# Altium project IntelligentJunctionBox_V1.PrjPcb
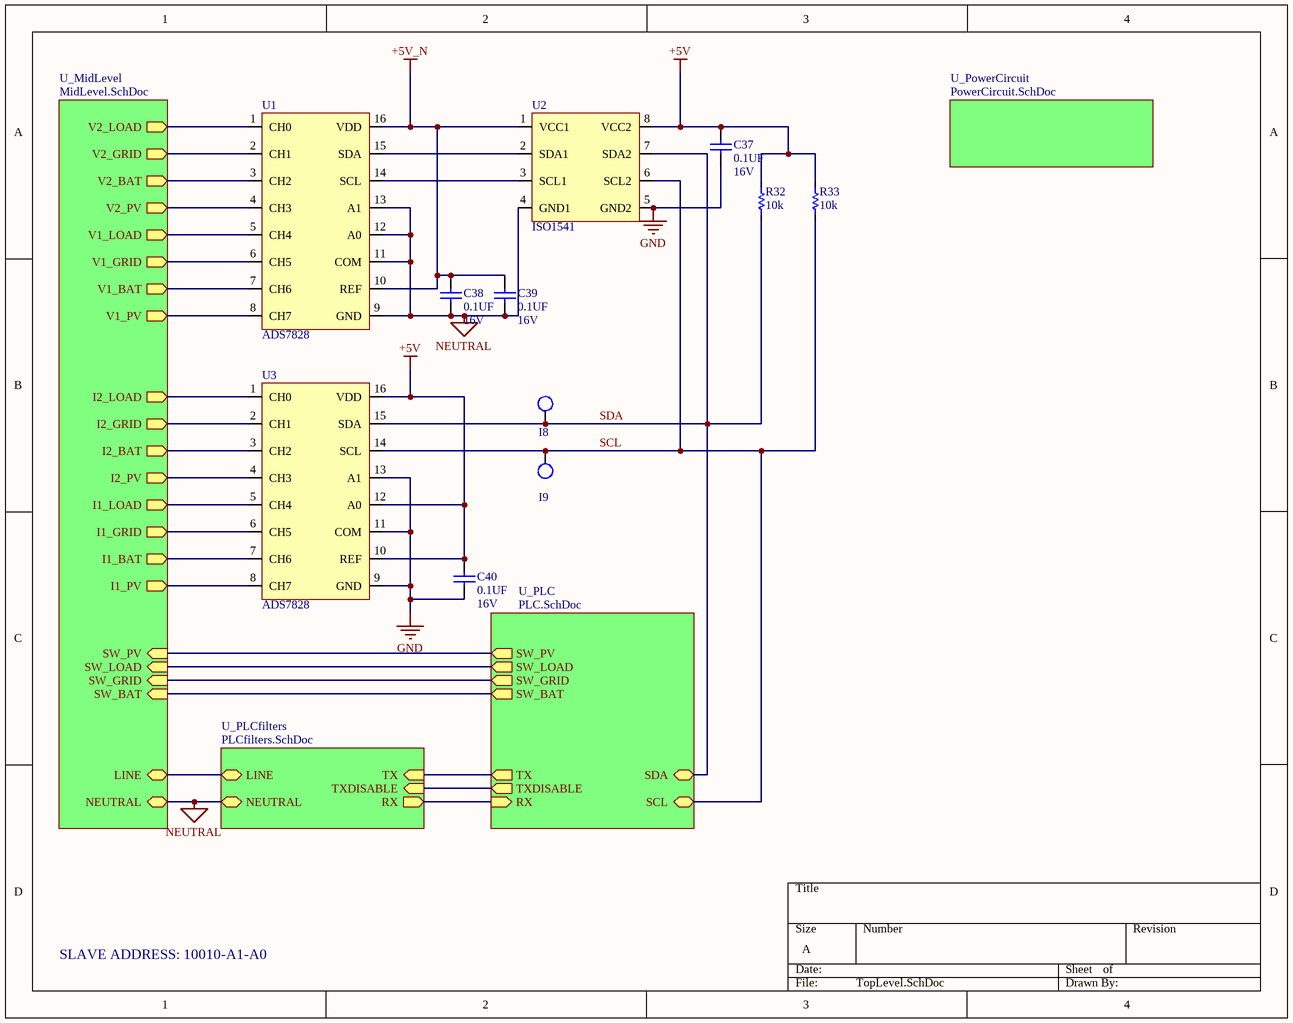
[diagram p0: TopLevel.SchDoc]
3 sheets, 42 parts. Net scope: hierarchical (ports join the sheet entries above them; power ports are global).
Board file: IntelligentJunctionBox_V1.PcbDoc
Sheets:
  TopLevel.SchDoc
    U_PLC = PLC.SchDoc
  Vsense.SchDoc

## Sheet TopLevel.SchDoc
size A

### Parts
C37  Capacitance: 0.1UF  Voltage - Rated: 16V  [CAPC1608X08N]  (hidden comment: GRM188R71C104KA01D)
C38  Capacitance: 0.1UF  Voltage - Rated: 16V  [CAPC1608X08N]  (hidden comment: GRM188R71C104KA01D)
C39  Capacitance: 0.1UF  Voltage - Rated: 16V  [CAPC1608X08N]  (hidden comment: GRM188R71C104KA01D)
C40  Capacitance: 0.1UF  Voltage - Rated: 16V  [CAPC1608X08N]  (hidden comment: GRM188R71C104KA01D)
I8  Testpoint  [Testpoint]  (value not drawn)
I9  Testpoint  [Testpoint]  (value not drawn)
R32  Resistance: 10k  [RESC1608X06N]  (hidden comment: RC0603FR-0710KL)
R33  Resistance: 10k  [RESC1608X06N]  (hidden comment: RC0603FR-0710KL)
U1  ADS7828  [TSOP65P640X120-16N]
U2  ISO1541  [SOIC127P600X175-8N]
U3  ADS7828  [TSOP65P640X120-16N]

### Sub-sheets
U_MidLevel = MidLevel.SchDoc (file not in this document): V1_PV (out), V2_PV (out), I1_PV (out), I2_PV (out), SW_PV (in), V1_LOAD (out), V2_LOAD (out), I1_LOAD (out), I2_LOAD (out), SW_LOAD (in), V1_GRID (out), V2_GRID (out), I1_GRID (out), I2_GRID (out), SW_GRID (in), V1_BAT (out), V2_BAT (out), I1_BAT (out), I2_BAT (out), SW_BAT (in), NEUTRAL (bidir), LINE (bidir)
U_PLC = PLC.SchDoc: TX (out), RX (in), TXDISABLE (out), SCL (bidir), SDA (bidir), SW_PV (out), SW_LOAD (out), SW_GRID (out), SW_BAT (out)
U_PLCfilters = PLCfilters.SchDoc (file not in this document): RX (out), TX (in), TXDISABLE (in), LINE (bidir), NEUTRAL (bidir)
U_PowerCircuit = PowerCircuit.SchDoc (file not in this document): no entries

### Nets
+5V: C37.2 C40.2 R32.2 R33.2 U2.8(VCC2) U3.10(REF) U3.12(A0) U3.16(VDD)
+5V_N: C38.2 C39.2 U1.10(REF) U1.16(VDD) U2.1(VCC1)
GND: C37.1 C40.1 U2.5(GND2) U3.9(GND) U3.11(COM) U3.13(A1)
NEUTRAL: C38.1 C39.1 U1.9(GND) U1.11(COM) U1.12(A0) U1.13(A1) U2.4(GND1) ; sheet U_MidLevel/NEUTRAL, sheet U_PLCfilters/NEUTRAL
SCL: I9.1(TP) R33.1 U2.6(SCL2) U3.14(SCL) ; sheet U_PLC/SCL
SDA: I8.1(TP) R32.1 U2.7(SDA2) U3.15(SDA) ; sheet U_PLC/SDA
SW_BAT: sheet U_MidLevel/SW_BAT, sheet U_PLC/SW_BAT
SW_GRID: sheet U_MidLevel/SW_GRID, sheet U_PLC/SW_GRID
SW_LD: sheet U_MidLevel/SW_LOAD, sheet U_PLC/SW_LOAD
SW_PV: sheet U_MidLevel/SW_PV, sheet U_PLC/SW_PV
NetU1_1: U1.1(CH0) ; sheet U_MidLevel/V2_LOAD
NetU1_2: U1.2(CH1) ; sheet U_MidLevel/V2_GRID
NetU1_3: U1.3(CH2) ; sheet U_MidLevel/V2_BAT
NetU1_4: U1.4(CH3) ; sheet U_MidLevel/V2_PV
NetU1_5: U1.5(CH4) ; sheet U_MidLevel/V1_LOAD
NetU1_6: U1.6(CH5) ; sheet U_MidLevel/V1_GRID
NetU1_7: U1.7(CH6) ; sheet U_MidLevel/V1_BAT
NetU1_8: U1.8(CH7) ; sheet U_MidLevel/V1_PV
NetU1_14: U1.14(SCL) U2.3(SCL1)
NetU1_15: U1.15(SDA) U2.2(SDA1)
NetU3_1: U3.1(CH0) ; sheet U_MidLevel/I2_LOAD
NetU3_2: U3.2(CH1) ; sheet U_MidLevel/I2_GRID
NetU3_3: U3.3(CH2) ; sheet U_MidLevel/I2_BAT
NetU3_4: U3.4(CH3) ; sheet U_MidLevel/I2_PV
NetU3_5: U3.5(CH4) ; sheet U_MidLevel/I1_LOAD
NetU3_6: U3.6(CH5) ; sheet U_MidLevel/I1_GRID
NetU3_7: U3.7(CH6) ; sheet U_MidLevel/I1_BAT
NetU3_8: U3.8(CH7) ; sheet U_MidLevel/I1_PV
NetU4_3: sheet U_PLCfilters/TX, sheet U_PLC/TX
NetU4_5: sheet U_PLCfilters/TXDISABLE, sheet U_PLC/TXDISABLE
NetU4_27: sheet U_PLCfilters/RX, sheet U_PLC/RX
(unnamed): sheet U_MidLevel/LINE, sheet U_PLCfilters/LINE

### Notes on the sheet
- SLAVE ADDRESS: 10010-A1-A0

### Library data of the parts
C37-C40 = GRM188R71C104KA01D: CAP CER 0.1UF 16V X7R 0603; Manufacturer: Murata Electronics North America; Manufacturer Part Number: GRM188R71C104KA01D; Supplier 1: Digi-Key; Supplier Part Number 1: 490-1532-1-ND
R32 R33 = RC0603FR-0710KL: RES SMD 10K OHM 1% 1/10W 0603; Manufacturer: Yageo; Manufacturer Part Number: RC0603FR-0710KL; Supplier 1: Digi-Key; Supplier Part Number 1: 311-10.0KHRCT-ND
U1 U3 = ADS7828: IC ADC 12BIT 50KSPS 8CH 16-TSSOP; Manufacturer: Texas Instruments; Manufacturer Part Number: ADS7828; Supplier 1: Digi-Key; Supplier Part Number 1: 296-38856-1-ND
U2 = ISO1541: DGTL ISO 2.5KV 2CH I2C 8SOIC; Manufacturer: Texas Instruments; Manufacturer Part Number: ISO1541; Supplier 1: Digi-Key; Supplier Part Number 1: 296-34895-5-ND

## Sheet PLC.SchDoc
size A
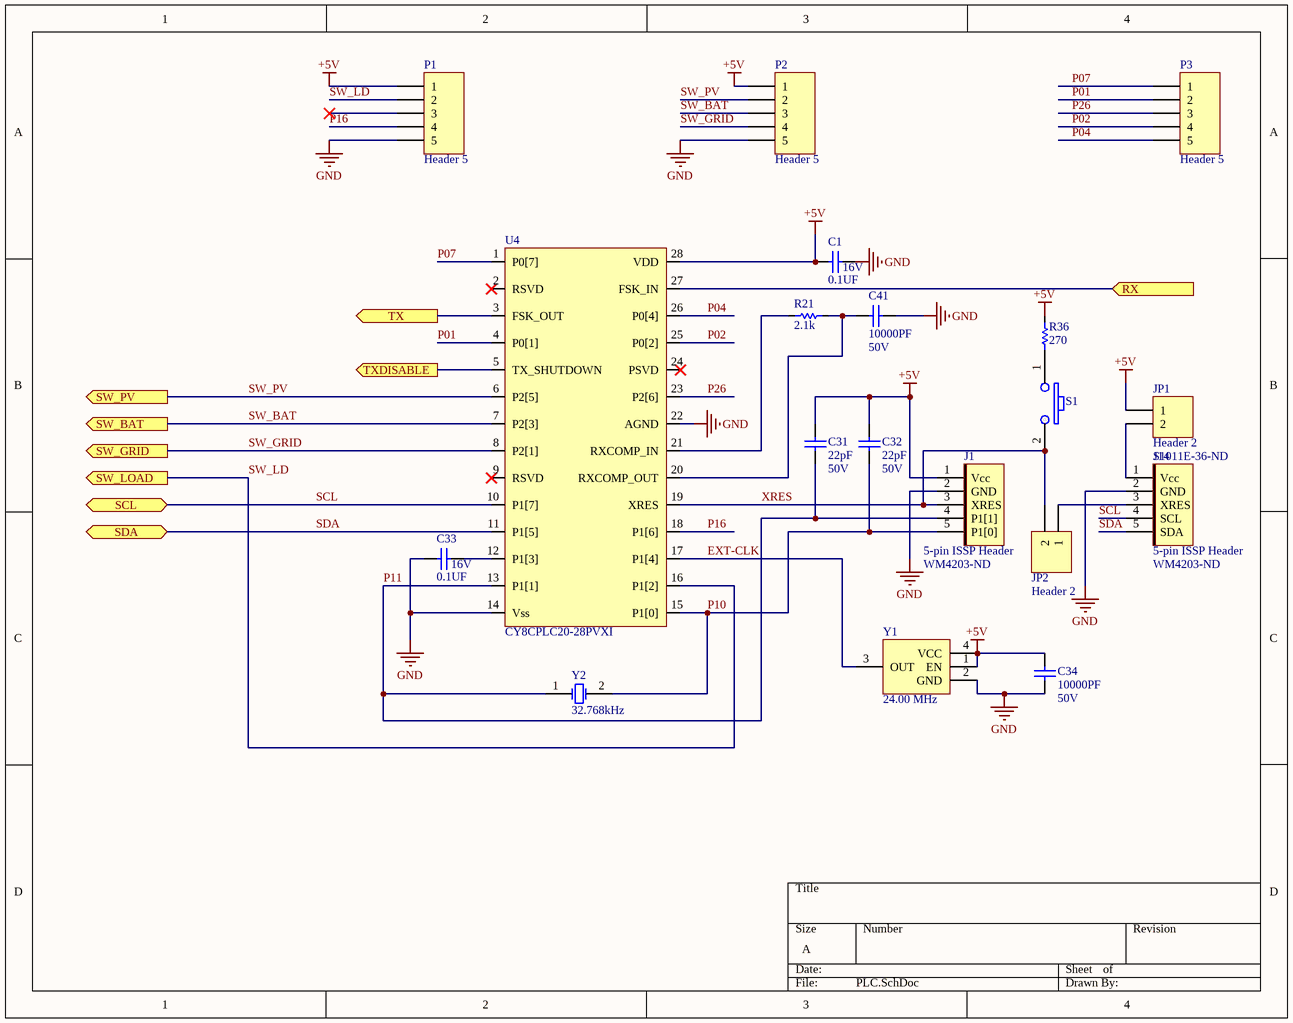
[diagram p1: PLC.SchDoc]

### Parts
C1  Capacitance: 0.1UF  Voltage - Rated: 16V  [CAPC1608X08N]  (hidden comment: GRM188R71C104KA01D)
C31  Capacitance: 22pF  Voltage - Rated: 50V  [CAPC1608X08N]  (hidden comment: GRM1885C1H220JA01D)
C32  Capacitance: 22pF  Voltage - Rated: 50V  [CAPC1608X08N]  (hidden comment: GRM1885C1H220JA01D)
C33  Capacitance: 0.1UF  Voltage - Rated: 16V  [CAPC1608X08N]  (hidden comment: GRM188R71C104KA01D)
C34  Capacitance: 10000PF  Voltage - Rated: 50V  [CAPC1608X08N]  (hidden comment: GRM188R71H103KA01D)
C41  Capacitance: 10000PF  Voltage - Rated: 50V  [CAPC1608X08N]  (hidden comment: GRM188R71H103KA01D)
J1  5-pin ISSP Header  Supplier Part Number 1: WM4203-ND  [ISPCON]
J14  5-pin ISSP Header  Supplier Part Number 1: WM4203-ND  [ISPCON]
JP1  Header 2  Supplier Part Number 1: S1011E-36-ND  [HDR1X2]
JP2  Header 2  [HDR1X2]
P1  Header 5  [HDR1X5]
P2  Header 5  [HDR1X5]
P3  Header 5  [HDR1X5]
R21  Resistance: 2.1k  [RESC1608X06N]  (hidden comment: RC0603FR-072K1L)
R36  Resistance: 270  [RESC1608X06N]  (hidden comment: RC0603JR-07270RL)
S1  B3F-1022  [STDSW]  (value not drawn)
U4  CY8CPLC20-28PVXI  [SOP65P780X200-28N]
Y1  value 24.00 MHz  [CSX-750F]  (hidden comment: CSX-750FCC24000000T)
Y2  32.768kHz  [XTAL32K]

### Ports
RX (in), SCL (bidir), SDA (bidir), SW_BAT (out), SW_GRID (out), SW_LOAD (out), SW_PV (out), TX (out), TXDISABLE (out)

### Nets
+5V: C1.1 C31.2 C32.2 C34.2 J1.1(Vcc) JP1.1 P1.1 P2.1 R36.2 U4.28(VDD) Y1.1(EN) Y1.4(VCC)
GND: C1.2 C33.1 C34.1 C41.1 J1.2(GND) J14.2(GND) P1.5 P2.5 U4.14(Vss) U4.22(AGND) Y1.2(GND)
EXT-CLK: U4.17(P1[4]) Y1.3(OUT)
P01: P3.2 U4.4(P0[1])
P02: P3.4 U4.25(P0[2])
P04: P3.5 U4.26(P0[4])
P07: P3.1 U4.1(P0[7])
P10: C32.1 J1.5(P1[0]) U4.15(P1[0]) Y2.2(OSC2)
P11: C31.1 J1.4(P1[1]) U4.13(P1[1]) Y2.1(OSC1)
P16: P1.4 U4.18(P1[6])
P26: P3.3 U4.23(P2[6])
SCL: J14.4(SCL) U4.10(P1[7]) ; port SCL
SDA: J14.5(SDA) U4.11(P1[5]) ; port SDA
SW_BAT: P2.3 U4.7(P2[3]) ; port SW_BAT
SW_GRID: P2.4 U4.8(P2[1]) ; port SW_GRID
SW_LD: P1.2 U4.16(P1[2]) ; port SW_LOAD
SW_PV: P2.2 U4.6(P2[5]) ; port SW_PV
XRES: J1.3(XRES) JP2.2 S1.2(NO) U4.19(XRES)
NetC33_2: C33.2 U4.12(P1[3])
NetC41_2: C41.2 R21.2 U4.20(RXCOMP_OUT)
NetJ14_1: J14.1(Vcc) JP1.2
NetJ14_3: J14.3(XRES) JP2.1
NetR21_1: R21.1 U4.21(RXCOMP_IN)
NetR36_1: R36.1 S1.1(C)
NetU4_3: U4.3(FSK_OUT) ; port TX
NetU4_5: U4.5(TX_SHUTDOWN) ; port TXDISABLE
NetU4_27: U4.27(FSK_IN) ; port RX

Not connected (* = marked no-connect by the designer): P1 3*; U4 2(RSVD)* 9(RSVD)* 24(PSVD)*

### Library data of the parts
C1 C33 = GRM188R71C104KA01D: as C37 on sheet TopLevel; Manufacturer Part Number: GRM188R71C104KA01D; Supplier 1: Digi-Key; Supplier Part Number 1: 490-1532-1-ND
C31 C32 = GRM1885C1H220JA01D: CAP CER 22PF 50V C0G/NP0 0603; Manufacturer: Murata Electronics North America; Manufacturer Part Number: GRM1885C1H220JA01D; Supplier 1: Digi-Key; Supplier Part Number 1: 490-1411-1-ND
C34 C41 = GRM188R71H103KA01D: CAP CER 10000PF 50V X7R 0603; Manufacturer: Murata Electronics North America; Manufacturer Part Number: GRM188R71H103KA01D; Supplier 1: Digi-Key; Supplier Part Number 1: 490-1512-1-ND
J1 = ISSP_CON: CONN HEADER 5POS .100 VERT TIN; Manufacturer: Molex; Manufacturer Part Number: 22-23-2051; Supplier 1: Digi-Key
J14 = I2C_Connector: CONN HEADER 5POS .100 VERT TIN; Manufacturer: Molex; Manufacturer Part Number: 22-23-2051; Supplier 1: Digi-Key
JP1 JP2 = Header 2: Header, 2-Pin; Manufacturer: Sullins Connector Solutions; Manufacturer Part Number: PBC36SAAN; Supplier 1: Digi-Key
  JP2: Supplier Part Number 1: S1011E-36-ND
P1-P3 = Header 5: Header, 5-Pin; Manufacturer Part Number: PBC36SAAN; Manufacturer: Sullins Connector Solutions; Supplier 1: Digi-Key; Supplier Part Number 1: S1011E-36-ND
R21 = RC0603FR-072K1L: RES SMD 2.1K OHM 1% 1/10W 0603; Manufacturer: Yageo; Manufacturer Part Number: RC0603FR-072K1L; Supplier 1: Digi-Key; Supplier Part Number 1: 311-2.10KHRCT-ND
R36 = RC0603JR-07270RL: RES SMD 270 OHM 5% 1/10W 0603; Manufacturer: Yageo; Manufacturer Part Number: RC0603JR-07270RL; Supplier 1: Digi-Key; Supplier Part Number 1: 311-270GRCT-ND
S1 = SPST: Swtich, SPST; Manufacturer: Omron; Manufacturer Part Number: B3F-1022; Supplier 1: Digi-Key; Supplier Part Number 1: SW403-ND
U4 = CY8CPLC20-28PVXI: IC PLC PSOC CMOS 28SSOP; Manufacturer: Cypress Semiconductor Corp; Manufacturer Part Number: CY8CPLC20-28PVXI; Supplier 1: Digi-Key; Supplier Part Number 1: CY8CPLC20-28PVXI-ND
Y1 = CSX-750FCC24000000T: OSC XO 24.000MHZ CMOS TTL SMD; Manufacturer: Citizen Finedevice Co Ltd; Manufacturer Part Number: CSX-750FCC24000000T; Supplier 1: Digi-Key; Supplier Part Number 1: 300-7214-1-ND
Y2 = XTAL: Crystal 32.768kHz 12.5pF; Manufacturer: ECS Inc.; Manufacturer Part Number: ECS-3X8X; Value: 32.768kHz; Supplier 1: Digi-Key; Supplier Part Number 1: X1123-ND

## Sheet Vsense.SchDoc
size A
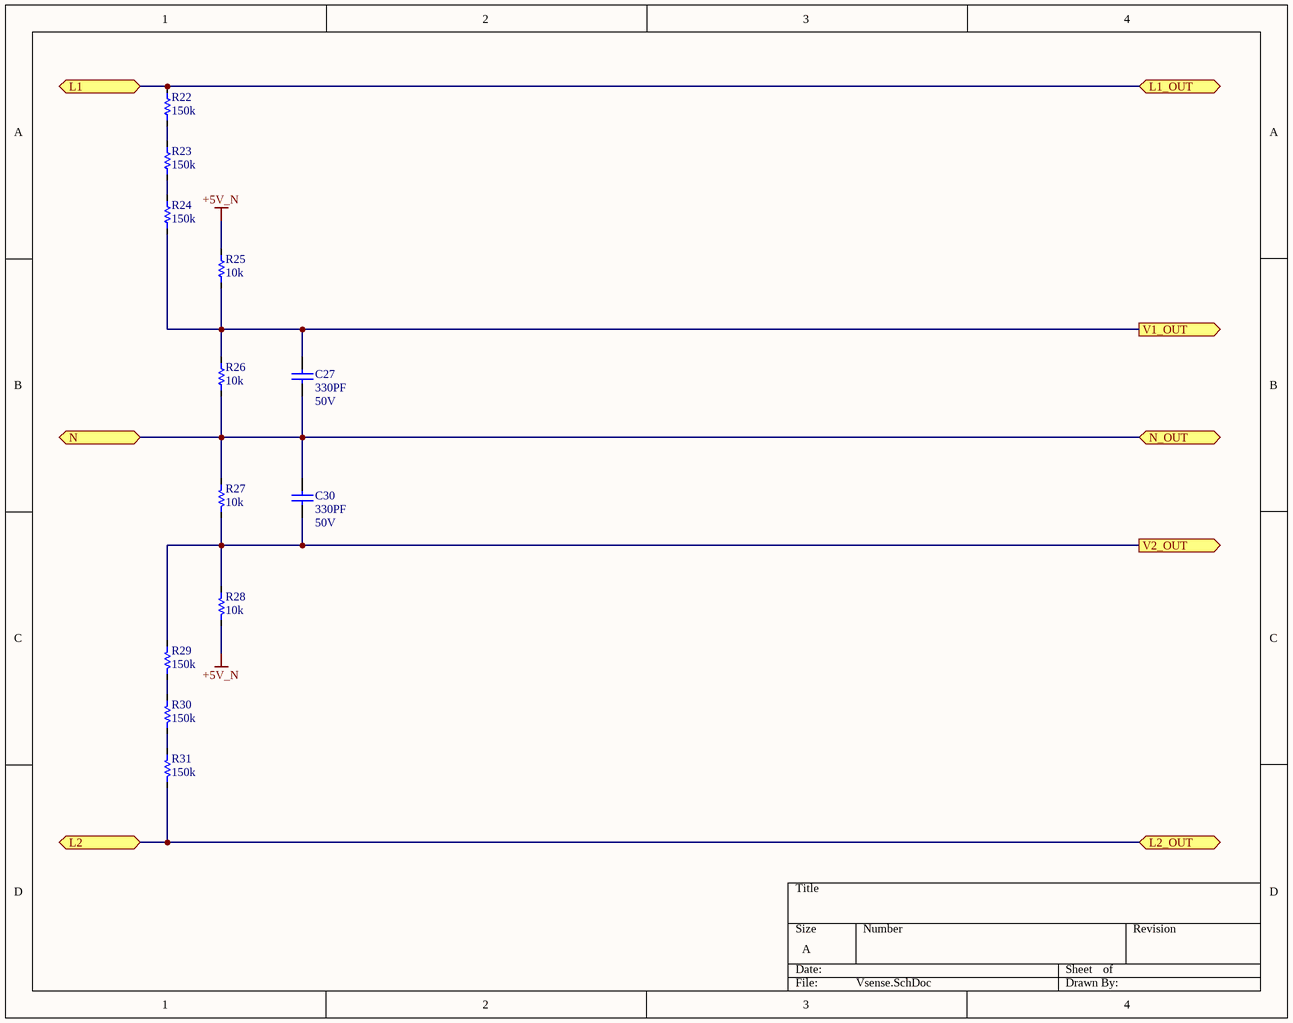
[diagram p2: Vsense.SchDoc]

### Parts
C27  Capacitance: 330PF  Voltage - Rated: 50V  [CAPC1608X08N]  (hidden comment: GRM188R71H331KA01D)
C30  Capacitance: 330PF  Voltage - Rated: 50V  [CAPC1608X08N]  (hidden comment: GRM188R71H331KA01D)
R22  Resistance: 150k  [RESC2012X06N]  (hidden comment: RC0805FR-07150KL)
R23  Resistance: 150k  [RESC2012X06N]  (hidden comment: RC0805FR-07150KL)
R24  Resistance: 150k  [RESC2012X06N]  (hidden comment: RC0805FR-07150KL)
R25  Resistance: 10k  [RESC1608X06N]  (hidden comment: RC0603FR-0710KL)
R26  Resistance: 10k  [RESC1608X06N]  (hidden comment: RC0603FR-0710KL)
R27  Resistance: 10k  [RESC1608X06N]  (hidden comment: RC0603FR-0710KL)
R28  Resistance: 10k  [RESC1608X06N]  (hidden comment: RC0603FR-0710KL)
R29  Resistance: 150k  [RESC2012X06N]  (hidden comment: RC0805FR-07150KL)
R30  Resistance: 150k  [RESC2012X06N]  (hidden comment: RC0805FR-07150KL)
R31  Resistance: 150k  [RESC2012X06N]  (hidden comment: RC0805FR-07150KL)

### Ports
L1 (bidir), L1_OUT (bidir), L2 (bidir), L2_OUT (bidir), N (bidir), N_OUT (bidir), V1_OUT (out), V2_OUT (out)

### Nets
+5V_N: R25.2 R28.2
NetC27_1: C27.1 C30.2 R26.1 R27.1 ; port N, port N_OUT
NetC27_2: C27.2 R24.1 R25.1 R26.2 ; port V1_OUT
NetC30_1: C30.1 R27.2 R28.1 R29.1 ; port V2_OUT
NetR22_1: R22.1 R23.2
NetR22_2: R22.2 ; port L1, port L1_OUT
NetR23_1: R23.1 R24.2
NetR29_2: R29.2 R30.1
NetR30_2: R30.2 R31.1
NetR31_2: R31.2 ; port L2, port L2_OUT

### Library data of the parts
C27 C30 = GRM188R71H331KA01D: CAP CER 330PF 50V X7R 0603; Manufacturer: Murata Electronics North America; Manufacturer Part Number: GRM188R71H331KA01D; Supplier 1: Digi-Key; Supplier Part Number 1: 490-1486-1-ND
R22-R24 R29-R31 = RC0805FR-07150KL: RES SMD 150K OHM 1% 1/8W 0805; Manufacturer: Yageo; Manufacturer Part Number: RC0805FR-07150KL; Supplier 1: Digi-Key; Supplier Part Number 1: 311-150KCRCT-ND
R25-R28 = RC0603FR-0710KL: as R32 on sheet TopLevel; Manufacturer Part Number: RC0603FR-0710KL; Supplier 1: Digi-Key; Supplier Part Number 1: 311-10.0KHRCT-ND

## Nets that join several sheets
+5V: TopLevel (8 pins), PLC (12 pins)
+5V_N: TopLevel (5 pins), Vsense (R25.2 R28.2)
GND: TopLevel (6 pins), PLC (11 pins)
SCL: TopLevel (I9.1 R33.1 U2.6 U3.14), PLC (J14.4 U4.10)
SDA: TopLevel (I8.1 R32.1 U2.7 U3.15), PLC (J14.5 U4.11)